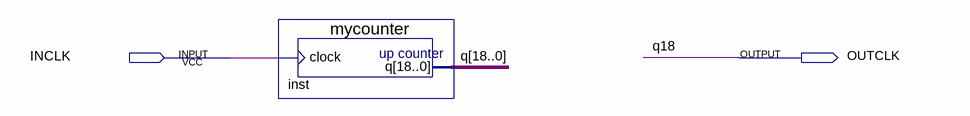
[diagram p0: schematic sheet]
// Quartus schematic myclockdivider.bdf as structural Verilog: 1 symbols, 2 pins
module myclockdivider (
  input  INCLK,
  output OUTCLK
);

  wire [17:0] q;

  mycounter inst (.clock(INCLK), .q({OUTCLK, q}));

  // Other names for the same wires on the sheet: q[18] = OUTCLK; q18 = OUTCLK
endmodule
